# EAGLE design shakeflasher (EAGLE 6.3)
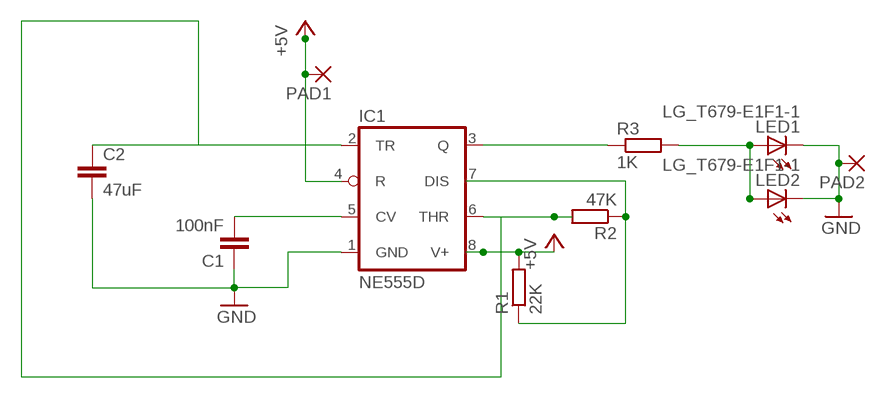
[diagram p0: schematic, sheet 1]

## Parts
C1  100nF  C-EUC0805  [C0805]
C2  47uF  C-EUC0805  [C0805]
IC1  NE555D  [SO08]
LED1  LG_T679-E1F1-1  [PLCC2]
LED2  LG_T679-E1F1-1  [PLCC2]
PAD1  SMD5  [SMD2,54-5,08]
PAD2  SMD5  [SMD2,54-5,08]
R1  22K  R-EU_R0805  [R0805]
R2  47K  R-EU_R0805  [R0805]
R3  1K  R-EU_R0805  [R0805]

## Nets
+5V: IC1.4(R) IC1.8(V+) PAD1.1(P) R1.2
GND: C1.1 C2.2 IC1.1(GND) LED1.C LED2.C PAD2.1(P)
N$1: LED1.A LED2.A R3.2
N$2: IC1.3(Q) R3.1
N$4: IC1.7(DIS) R1.1 R2.1
N$8: C2.1 IC1.2(TR) IC1.6(THR) R2.2
V: C1.2 IC1.5(CV)

## Library data of the parts
C1 C2 = resistor:C-EU: CAPACITOR, European symbol
IC1 = linear4:*555: TIMER
LED1 LED2 = led:*_T679-?-1: LC TOPLED® Low Current LED Source: http://catalog.osram-os.com .. LG_LS_LY_T679_OBS.pdf; COLOR: green
PAD1 PAD2 = wirepad:SMD5: SMD PAD
R1-R3 = resistor:R-EU_: RESISTOR, European symbol

## Board
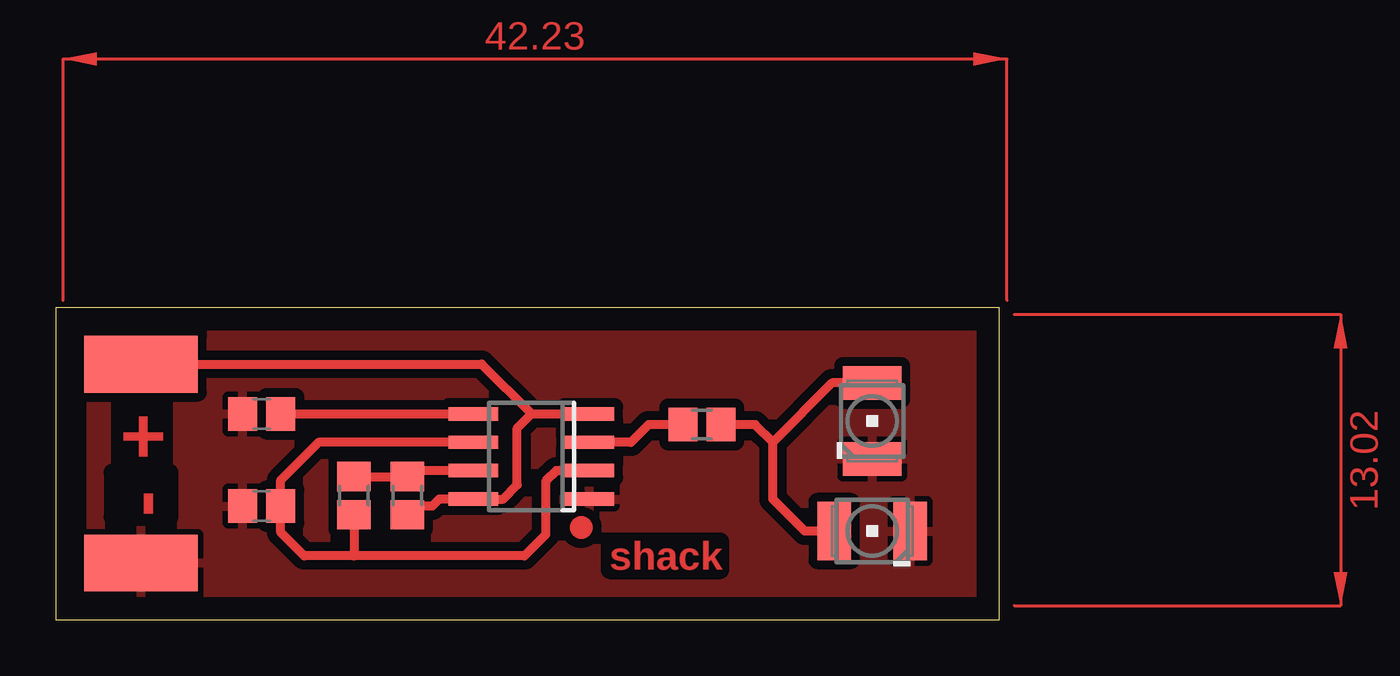
[diagram p1: board, top side]

Size 42.21 x 13.96 mm. Coordinates in mm from the lower left corner, seen from the top.
Outline: 0,0 42.21,0 42.21,13.96 0,13.96 0,0
Copper layers (1*16): Top 0.035mm / dielectric 1.5mm / Bottom 0.035mm
Design rules "default": minimum track width 10mil, minimum drill 24mil, track to track 8mil, track to pad 8mil, pad to pad 8mil, via to via 8mil, smd to smd 8mil, copper to edge 40mil, drill to drill 8mil, minimum pad ring 10mil, minimum via ring 8mil, stop-mask expansion 4mil, vias tented up to drill 0mil, thermal gap 10mil

### Footprints (pad centres in the part's own frame; a part is rotated, then mirrored left to right if it is on the bottom)
C0805 = smd 1.3 x 1.5: 1 -0.85,0; 2 0.85,0
SO08 = smd 0.6 x 2.2: 1 -1.905,-2.6; 2 -0.635,-2.6; 3 0.635,-2.6; 4 1.905,-2.6; 5 1.905,2.6; 6 0.635,2.6; 7 -0.635,2.6; 8 -1.905,2.6
PLCC2 = smd 2.6 x 1.5: A 0,1.7; C 0,-1.7
SMD2,54-5,08 = smd 2.54 x 5.08: 1 0,0
R0805 = smd 1.3 x 1.5: 1 -0.85,0; 2 0.85,0

### Placement (x,y rotation side)
C1  9.21,9.21 0 top
C2  9.21,5.08 180 top
IC1  21.27,7.3 90 top
LED1  36.51,3.97 90 top
LED2  36.51,8.89 0 top
PAD1  3.81,11.43 270 top
PAD2  3.81,2.54 270 top
R1  15.72,5.56 270 top
R2  13.33,5.56 270 top
R3  28.89,8.73 0 top

### Tracks (layer width: path | path; a pad name or v marks a point on that pad's centre or on a via)
+5V
  Top 0.406: 21.27,9.21 20.64,8.57 20.64,6.03 20,5.4 IC1.8 17.15,5.4 16.83,5.08 16.09,5.08 R1.2 | PAD1.1 19.05,11.43 21.27,9.21 | 21.27,9.21 IC1.4
GND
  pour Top (isolate 0.406): 1.59,14.29 42.55,14.29 42.55,-0.32 1.59,-0.64
N$1
  Top 0.406: LED1.A 33.5,3.97 32.07,5.4 32.07,7.94 | 32.07,7.94 31.27,8.73 R3.2 | LED2.A 34.72,10.59 32.07,7.94
N$2
  Top 0.406: R3.1 26.51,8.73 25.72,7.94 IC1.3
N$4
  Top 0.406: IC1.7 15.98,6.67 arc90 R1.1 R2.1
N$8
  Top 0.406: IC1.6 11.75,7.94 10.06,6.25 C2.1 10.06,3.91 11.11,2.86 13.33,2.86 | IC1.2 22.38,6.67 21.91,6.19 21.91,3.81 20.96,2.86 13.33,2.86 | R2.2 13.33,2.86
V
  Top 0.406: C1.2 IC1.5
(copper drawn outside any net)
  shapes: Top area x2, Top circle x1

### Text on the board
Top: + | - | shack